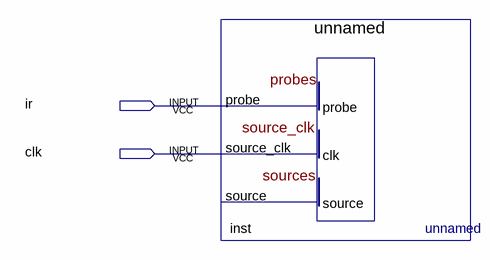
[diagram p0: schematic sheet]
// Quartus schematic ir.bdf as structural Verilog: 1 symbols, 2 pins
module ir (
  input  ir,
  input  clk
);

  unnamed inst (.probe(ir), .source_clk(clk));  // open: source
endmodule
